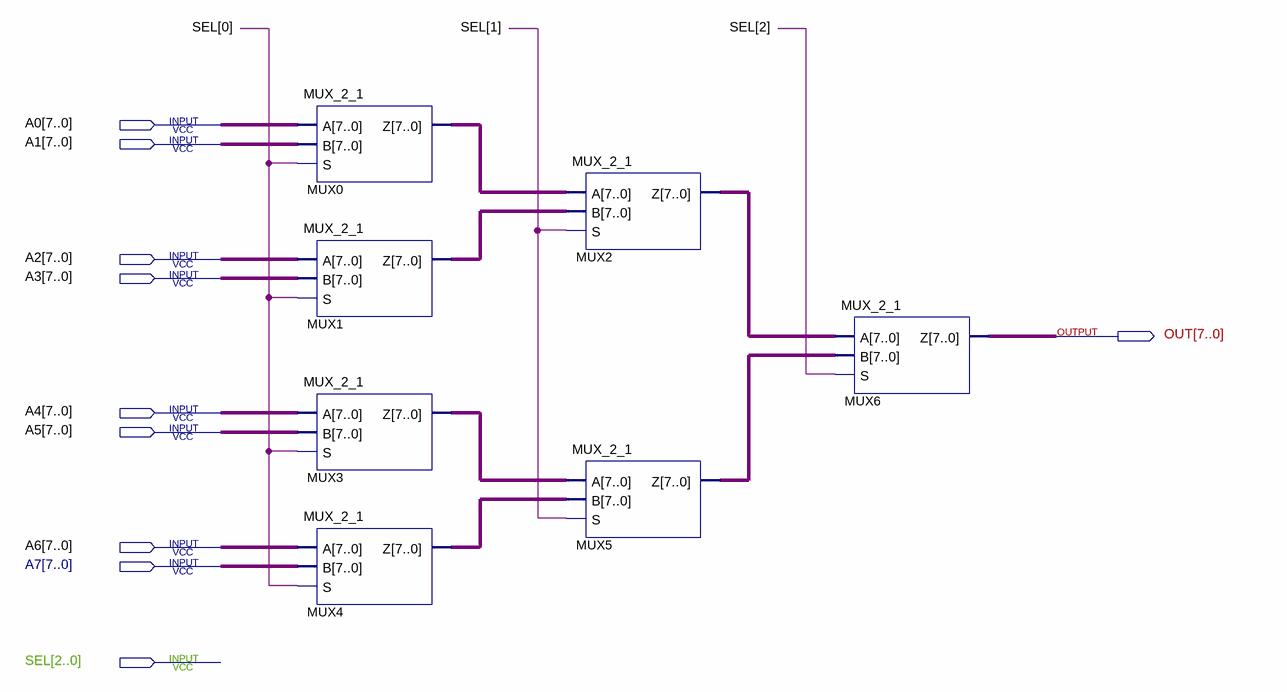
[diagram p0: schematic sheet]
// Quartus schematic MUX_8_1.bdf as structural Verilog: 7 symbols, 10 pins
module MUX_8_1 (
  input  [7:0] A0,
  input  [7:0] A1,
  input  [7:0] A2,
  input  [7:0] A3,
  input  [7:0] A4,
  input  [7:0] A5,
  input  [7:0] A6,
  input  [7:0] A7,
  input  [2:0] SEL,
  output [7:0] OUT
);

  wire [7:0] MUX0_z, MUX1_z, MUX2_z, MUX3_z, MUX4_z, MUX5_z;

  MUX_2_1 MUX0 (.A(A0), .B(A1), .S(SEL[0]), .Z(MUX0_z));
  MUX_2_1 MUX1 (.A(A2), .B(A3), .S(SEL[0]), .Z(MUX1_z));
  MUX_2_1 MUX3 (.A(A4), .B(A5), .S(SEL[0]), .Z(MUX3_z));
  MUX_2_1 MUX4 (.A(A6), .B(A7), .S(SEL[0]), .Z(MUX4_z));
  MUX_2_1 MUX2 (.A(MUX0_z), .B(MUX1_z), .S(SEL[1]), .Z(MUX2_z));
  MUX_2_1 MUX5 (.A(MUX3_z), .B(MUX4_z), .S(SEL[1]), .Z(MUX5_z));
  MUX_2_1 MUX6 (.A(MUX2_z), .B(MUX5_z), .S(SEL[2]), .Z(OUT));
endmodule
